# Altium project HMC480.PrjPcb
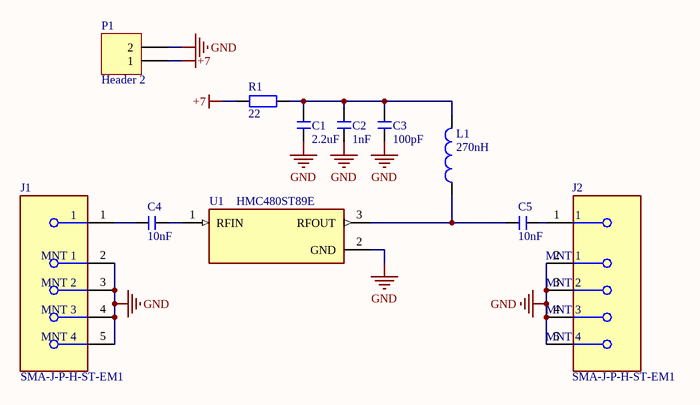
[diagram p0: HMC480.SchDoc]
1 sheet, 11 parts. Net scope: global (net labels, ports and power ports of the same name join across sheets).
Board file: HMC480.PcbDoc

## Sheet HMC480.SchDoc
size A2; SheetNumber: 1; SheetTotal: 1

### Parts
C1  2.2uF  [C 0603_L]
C2  1nF  [C 0603_L]
C3  100pF  [C 0603_L]
C4  10nF  [C 0603_L]
C5  10nF  [C 0603_L]
J1  SMA-J-P-H-ST-EM1  [FP-SMA-J-P-H-ST-EM1-MFG]
J2  SMA-J-P-H-ST-EM1  [FP-SMA-J-P-H-ST-EM1-MFG]
L1  270nH  [L 0805]
P1  Header 2  [HDR1X2]
R1  22  [R 1812_M]
U1  HMC480ST89E  [FP-RK-3-MFG]

### Nets
+7: P1.1 R1.1
GND: C1.1 C2.1 C3.1 J1.2(MNT_1) J1.3(MNT_2) J1.4(MNT_3) J1.5(MNT_4) J2.2(MNT_1) J2.3(MNT_2) J2.4(MNT_3) J2.5(MNT_4) P1.2 U1.2(GND)
NetC1_2: C1.2 C2.2 C3.2 L1.2 R1.2
NetC4_1: C4.1 J1.1
NetC4_2: C4.2 U1.1(RFIN)
NetC5_1: C5.1 L1.1 U1.3(RFOUT)
NetC5_2: C5.2 J2.1

### Library data of the parts
C1-C5 = C: 贴片电容; 淘宝ID: 小糖豆的小窝窝; BOM名称: 贴片电容; 下单链接: https://item.taobao.com/item.htm?ft=t&id=613637044352
J1 J2 = CMP-02754-000006-1: CONN SMA JACK STR 50OHM EDGE MNT; Dielectric Material: PTFE; Center Contact Plating: Gold; Max Frequency: 6GHz; Body Material: Brass; Voltage Rating: 335V; Impedance: 50R; Package Quantity: 1; Case/Package: SMA; Max Operating Temperature: 125°C; Fastening Type: Threaded; Orientation: Straight; Depth: 13.33mm; RoHS Compliant: Yes; Length: 6.35mm; Insulation Material: Polytetrafluoroethylene; Termination: Solder; Min Operating Temperature: -65°C; Housing Color: Gold; Contact Plating: Gold; Contact Material: Copper; Connector Type: SMA; Mount: Edge; Series: SMA; Packaging: Tray; Body Plating: Gold; Radiation Hardening: No
L1 = L: 小功率贴片电感; BOM名称: 小功率贴片电感; 下单链接: https://item.taobao.com/item.htm?ft=t&id=613637044352
P1 = Header 2: Header, 2-Pin; LatestRevisionDate: 17-Jul-2002; LatestRevisionNote: Re-released for DXP Platform.; Publisher: Altium Limited
R1 = R: 贴片电阻; 淘宝ID: 小糖豆的小窝窝; BOM名称: 贴片电阻; 下单链接: https://item.taobao.com/item.htm?ft=t&id=613637044352
U1 = CMP-09142-000230-1: IC RF AMP GP 0HZ-5GHZ SOT89; P1dB: 20dBm; Operating Supply Voltage: 8V; Operating Supply Current: 82mA; Max Frequency: 5GHz; Noise Figure: 4dB; Max Power Dissipation: 536mW; Min Supply Voltage: 6V; Operating Frequency: DC to 5 GHz; Gain: 19dB; Number of Channels: 1; Max Operating Temperature: 85°C; Min Operating Temperature: -40°C; Mount: Surface Mount; Lead Free: Contains Lead; Package Quantity: 50; Number of Pins: 3; Contact Plating: Tin; Weight: 0.004603oz; Packaging: Strip; RoHS Compliant: Yes; Series: -; Case/Package: TO-243AA; Max Supply Voltage: 8V